# Altium schematic sheet INA282.SchDoc
size A4
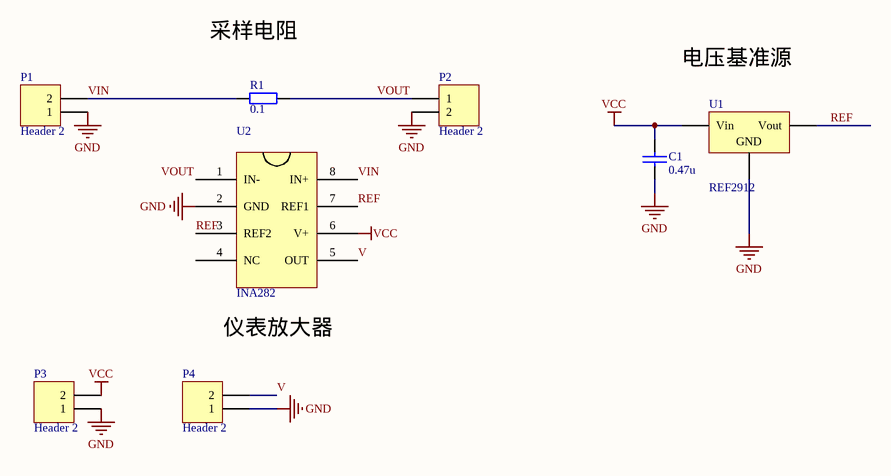
[diagram p0: INA282.SchDoc]

## Parts
C1  0.47u  [0805C]
P1  Header 2  [HDR1X2]
P2  Header 2  [HDR1X2]
P3  Header 2  [HDR1X2]
P4  Header 2  [HDR1X2]
R1  value 0.1  [R 2512-HP_M]  (hidden comment: Res2)
U1  REF2912  [LM1117]
U2  INA282  [SO8_N]

## Nets
GND: C1.1 P1.1 P2.2 P3.1 P4.1 U1.1(GND) U2.2(GND)
VCC: C1.2 P3.2 U1.3(Vin) U2.6(V+)
REF: U1.2(Vout) U2.3(REF2) U2.7(REF1)
V: P4.2 U2.5(OUT)
VIN: P1.2 R1.2 U2.8(IN+)
VOUT: P2.1 R1.1 U2.1(IN-)

Not connected (* = marked no-connect by the designer): U2 4(NC)

## Notes on the sheet
- 采样电阻
- 电压基准源
- 仪表放大器

## Library data of the parts
C1 = CAP: Capacitor
P1-P4 = Header 2: Header, 2-Pin; LatestRevisionDate: 17-Jul-2002; LatestRevisionNote: Re-released for DXP Platform.; Publisher: Altium Limited
R1 = Res2: Resistor; Published: 8-Jun-2000; LatestRevisionDate: 17-Jul-2002; LatestRevisionNote: Re-released for DXP Platform.; PackageReference: AXIAL-0.4; Publisher: Altium Limited; PackageDescription: Axial Device, Thru-Hole; 2 Leads; 0.4 in Pin Spacing
U1 = AMS1117